# EAGLE design basic (EAGLE 9.6.2)
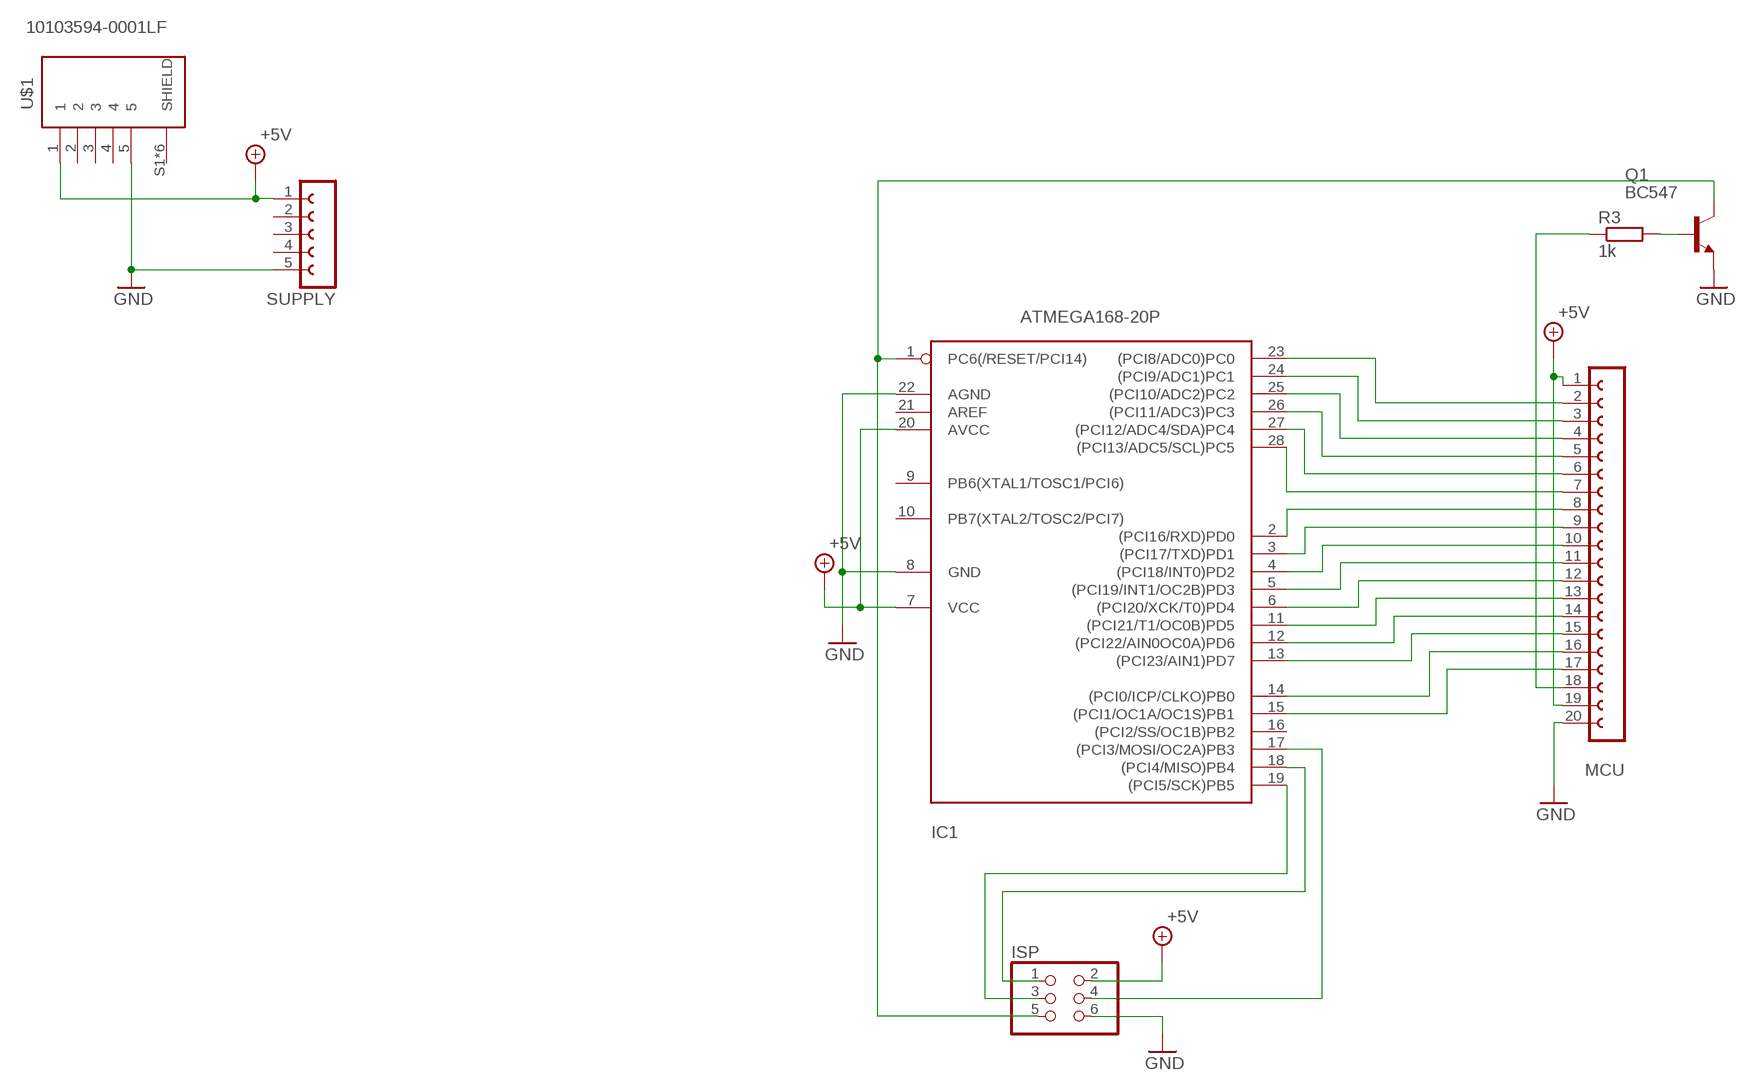
[diagram p0: schematic, sheet 1]

## Parts
IC1  ATMEGA168-20P  [DIL28-3]
ISP  PINHD-2X3  [2X03]
MCU  FE20-1  [FE20]
Q1  BC547  [TO92]
R3  1k  R-EU_0207/10  [0207/10]
SUPPLY  FE05-1  [FE05-1]
U$1  10103594-0001LF  [FCI_10103594-0001LF]

## Nets
+5V: IC1.7(VCC) IC1.20(AVCC) ISP.2 MCU.1 MCU.19 SUPPLY.1 U$1.1
GND: IC1.8(GND) IC1.22(AGND) ISP.6 MCU.20 Q1.1(E) SUPPLY.5 U$1.5
N$1: IC1.17((PCI3/MOSI/OC2A)PB3) ISP.4
N$2: MCU.18 R3.1
N$3: IC1.18((PCI4/MISO)PB4) ISP.1
N$4: IC1.19((PCI5/SCK)PB5) ISP.3
N$5: IC1.23((PCI8/ADC0)PC0) MCU.2
N$6: IC1.24((PCI9/ADC1)PC1) MCU.3
N$7: IC1.25((PCI10/ADC2)PC2) MCU.4
N$8: IC1.26((PCI11/ADC3)PC3) MCU.5
N$9: IC1.27((PCI12/ADC4/SDA)PC4) MCU.6
N$10: IC1.28((PCI13/ADC5/SCL)PC5) MCU.7
N$11: IC1.2((PCI16/RXD)PD0) MCU.8
N$12: IC1.3((PCI17/TXD)PD1) MCU.9
N$13: IC1.4((PCI18/INT0)PD2) MCU.10
N$14: IC1.5((PCI19/INT1/OC2B)PD3) MCU.11
N$15: IC1.6((PCI20/XCK/T0)PD4) MCU.12
N$16: IC1.11((PCI21/T1/OC0B)PD5) MCU.13
N$17: Q1.2(B) R3.2
N$18: IC1.12((PCI22/AIN0OC0A)PD6) MCU.14
N$19: IC1.1(PC6(/RESET/PCI14)) ISP.5 Q1.3(C)
N$20: IC1.13((PCI23/AIN1)PD7) MCU.15
N$21: IC1.14((PCI0/ICP/CLKO)PB0) MCU.16
N$22: IC1.15((PCI1/OC1A/OC1S)PB1) MCU.17
Unconnected: IC1.9(PB6(XTAL1/TOSC1/PCI6)) IC1.10(PB7(XTAL2/TOSC2/PCI7)) IC1.16((PCI2/SS/OC1B)PB2) IC1.21(AREF) SUPPLY.2 SUPPLY.3 SUPPLY.4 U$1.2 U$1.3 U$1.4 U$1.S1(SHIELD) U$1.S2(SHIELD) U$1.S3(SHIELD) U$1.S4(SHIELD) U$1.S5(SHIELD) U$1.S6(SHIELD)

## Library data of the parts
IC1 = adafruit:ATMEGA168*P: MICROCONTROLLER 16 kBytes FLASH 1 kBytes SRAM 512 Bytes EEPROM USART 8-channel 10 bit ADC
ISP = pinhead:PINHD-2X3: PIN HEADER
MCU = con-lsta:FE20-1: FEMALE HEADER; OC_FARNELL: unknown; OC_NEWARK: unknown
Q1 = transistor-npn:BC547*: NPN Transistor
R3 = rcl:R-EU_: RESISTOR, European symbol; SPICEPREFIX: R
SUPPLY = con-lsta:FE05-1: FEMALE HEADER; OC_FARNELL: unknown; OC_NEWARK: unknown
U$1 = 10103594-0001LF:10103594-0001LF: Micro Usb, 2.0 Type b, Receptacle, Smt; ARROW_ELECTRONICS-PURCHASE-URL: https://snapeda.com/shop?store=Arrow+Electronics&id=1078241; DESCRIPTION: USB - micro B USB 2.0 Receptacle Connector 5 Position Surface Mount, Right Angle; Through Hole; DIGI-KEY_PART_NUMBER: 609-4050-1-ND; DIGIKEY-PURCHASE-URL: https://snapeda.com/shop?store=DigiKey&id=1078241; MF: Amphenol ICC; MOUSER-PURCHASE-URL: https://snapeda.com/shop?store=Mouser&id=1078241; MP: 10103594-0001LF; PACKAGE: None

## Board
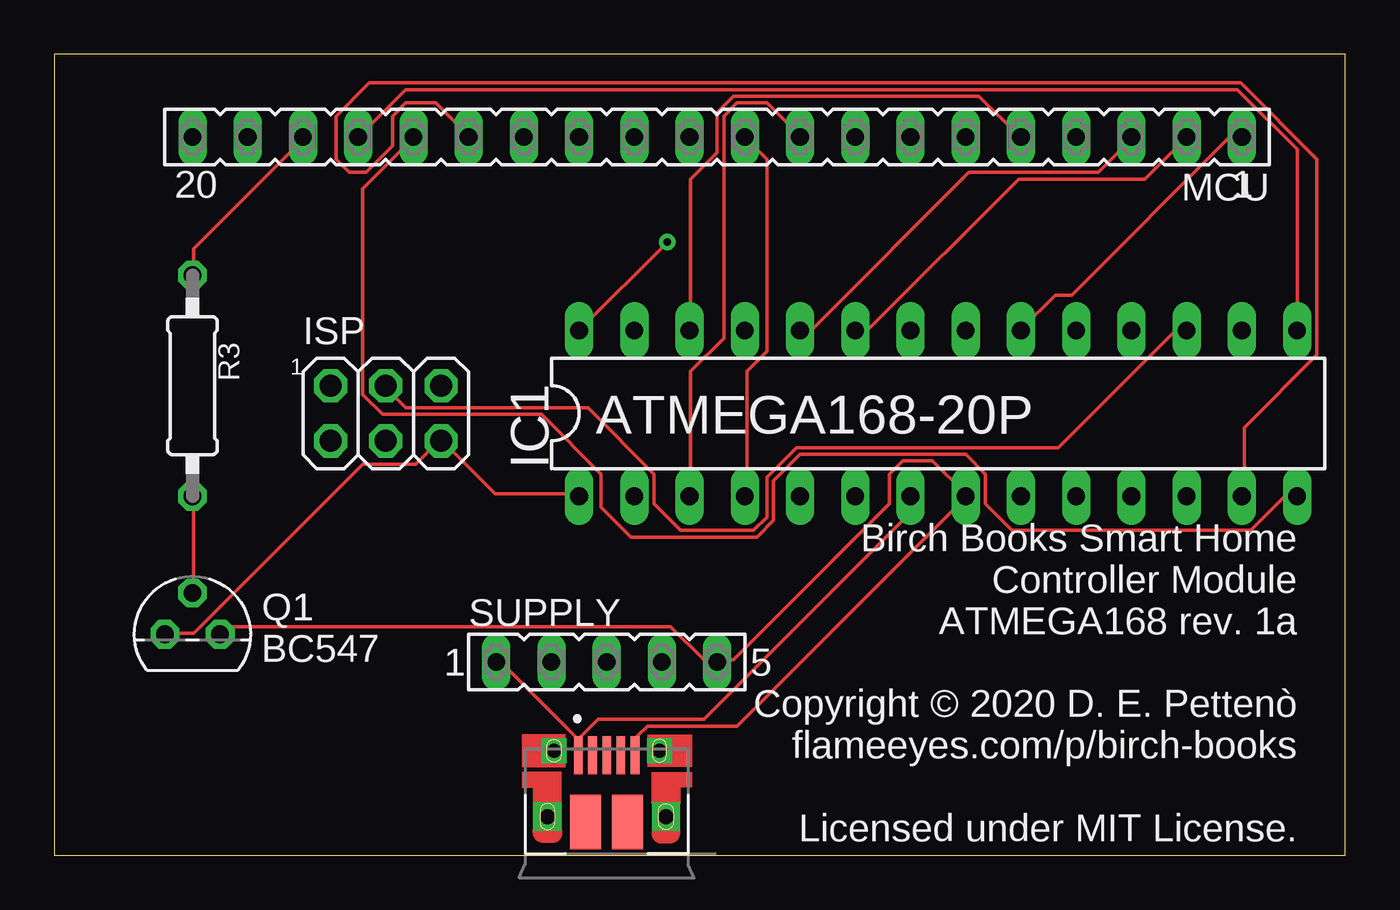
[diagram p1: board, top side]
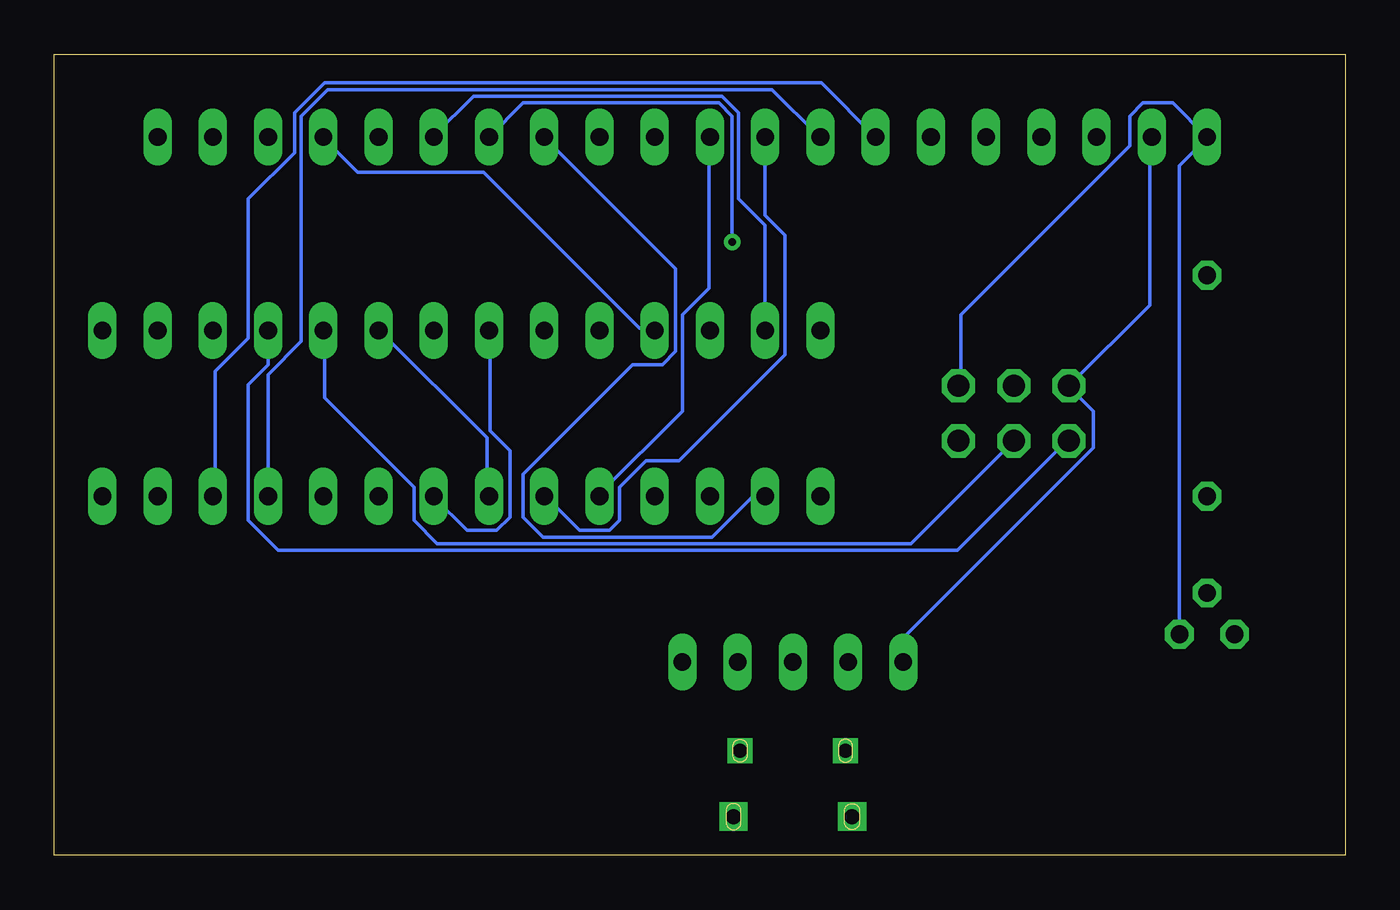
[diagram p2: board, bottom side, seen from below]

Size 59.36 x 36.82 mm. Coordinates in mm from the lower left corner, seen from the top.
Outline: 0,0 59.36,0 59.36,36.82 0,36.82 0,0
Copper layers (1*16): Top 0.035mm / dielectric 1.5mm / Bottom 0.035mm
Design rules "default": minimum track width 6mil, minimum drill 0.35mm, track to track 6mil, track to pad 6mil, pad to pad 6mil, via to via 6mil, smd to smd 6mil, copper to edge 40mil, drill to drill 6mil, minimum pad ring 10mil, minimum via ring 8mil, stop-mask expansion 4mil, vias tented up to drill 0mil, thermal gap 10mil

### Footprints (pad centres in the part's own frame; a part is rotated, then mirrored left to right if it is on the bottom)
DIL28-3 = drill 0.813 long: 1 -16.51,-3.81; 2 -13.97,-3.81; 3 -11.43,-3.81; 4 -8.89,-3.81; 5 -6.35,-3.81; 6 -3.81,-3.81; 7 -1.27,-3.81; 8 1.27,-3.81; 9 3.81,-3.81; 10 6.35,-3.81; 11 8.89,-3.81; 12 11.43,-3.81; 13 13.97,-3.81; 14 16.51,-3.81; 15 16.51,3.81; 16 13.97,3.81; 17 11.43,3.81; 18 8.89,3.81; 19 6.35,3.81; 20 3.81,3.81; 21 1.27,3.81; 22 -1.27,3.81; 23 -3.81,3.81; 24 -6.35,3.81; 25 -8.89,3.81; 26 -11.43,3.81; 27 -13.97,3.81; 28 -16.51,3.81
2X03 = drill 1.016 octagon: 1 -2.54,-1.27; 2 -2.54,1.27; 3 0,-1.27; 4 0,1.27; 5 2.54,-1.27; 6 2.54,1.27
FE20 = drill 0.813 long: 1 -24.13,0; 2 -21.59,0; 3 -19.05,0; 4 -16.51,0; 5 -13.97,0; 6 -11.43,0; 7 -8.89,0; 8 -6.35,0; 9 -3.81,0; 10 -1.27,0; 11 1.27,0; 12 3.81,0; 13 6.35,0; 14 8.89,0; 15 11.43,0; 16 13.97,0; 17 16.51,0; 18 19.05,0; 19 21.59,0; 20 24.13,0
TO92 = drill 0.813 octagon: 1 1.27,0; 2 0,1.905; 3 -1.27,0
0207/10 = drill 0.813 octagon: 1 -5.08,0; 2 5.08,0
FE05-1 = drill 0.813 long: 1 -5.08,0; 2 -2.54,0; 3 0,0; 4 2.54,0; 5 5.08,0
FCI_10103594-0001LF = smd 0.4 x 1.75: 1 -1.3,2.825; 2 -0.65,2.825; 3 0,2.825; 4 0.65,2.825; 5 1.3,2.825 | smd 1.425 x 2.5: S1 -0.963,-0.25; S2 0.963,-0.25 | drill 0.65 pad 1.05 square: S3 -2.425,3.03; S4 2.425,3.03 | drill 0.7 pad 1.3 square: S5 -2.725,0; S6 2.725,0

### Placement (x,y rotation side)
IC1  40.64,20.32 0 top
ISP  15.24,20.32 0 top
MCU  30.48,33.02 180 top
Q1  6.35,10.16 0 top
R3  6.35,21.59 270 top
SUPPLY  25.4,8.89 0 top
U$1  25.4,1.78 0 top

### Tracks (layer width: path | path; a pad name or v marks a point on that pad's centre or on a via)
+5V
  Top 0.152: MCU.1 54.56,32.92 53.95,32.92 46.79,25.76 46.02,25.76 44.5,24.23 IC1.20 | 24.08,5.33 24.08,4.72 U$1.1 24.08,5.33 | 24.08,5.33 20.42,8.99 SUPPLY.1 | 24.08,5.33 24.99,6.25 29.87,6.25 39.32,15.7 39.32,16.46 IC1.7
  Bottom 0.152: IC1.7 39.47,16.61 39.47,19.2 44.35,24.08 IC1.20 | MCU.19 8.99,32.92 8.99,25.3 ISP.2 12.65,21.49 11.58,20.42 11.58,18.75 20.27,10.06 20.27,8.99 SUPPLY.1
GND
  Top 0.152: U$1.5 26.82,4.72 26.82,5.49 27.28,5.94 31.39,5.94 41.91,16.46 IC1.8 41.91,16.61 40.39,18.14 39.01,18.14 38.41,17.53 38.41,16.15 31.24,8.99 30.48,8.99 | 30.48,8.99 29.87,8.99 28.35,10.52 7.92,10.52 7.62,10.21 Q1.1 | 30.48,8.99 SUPPLY.5
  Bottom 0.152: IC1.22 39.32,24.08 39.32,19.51 38.41,18.59 38.41,15.54 39.01,14.94 40.39,14.94 41.91,16.46 IC1.8 | Q1.1 7.62,31.7 6.4,32.92 MCU.20 7.92,34.59 9.3,34.59 9.91,33.98 9.91,32.61 17.68,24.84 17.68,21.64 ISP.6
N$1
  Top 0.152: IC1.17 51.97,24.08 51.51,24.08 46.18,18.75 34.14,18.75 32.77,17.37 32.77,15.54 32.16,14.94 28.8,14.94 27.58,16.15 27.58,17.53 24.54,20.57 16.15,20.57 15.24,21.49 ISP.4
N$2
  Top 0.152: R3.1 6.4,26.67 6.4,27.89 11.43,32.92 MCU.18
N$3
  Bottom 0.152: IC1.18 49.53,22.55 50.44,21.64 50.44,15.39 49.07,14.02 17.83,14.02 12.8,19.05 ISP.1
N$4
  Bottom 0.152: ISP.3 19.96,14.33 41.76,14.33 42.82,15.39 42.82,16.92 46.94,21.03 46.94,24.08 IC1.19
N$5
  Top 0.152: MCU.2 50.14,31.09 44.35,31.09 37.49,24.23 36.88,24.23 IC1.23
N$6
  Top 0.152: IC1.24 34.29,24.23 34.9,24.23 42.06,31.39 48.01,31.39 49.53,32.92 MCU.3
N$7
  Bottom 0.152: IC1.25 31.85,24.23 32.46,24.23 39.62,31.39 45.41,31.39 46.94,32.92 MCU.4
N$8
  Top 0.152: IC1.26 29.26,24.23 29.26,31.09 30.48,32.31 30.48,34.14 31.24,34.9 42.52,34.9 44.35,33.07 MCU.5
N$9
  Bottom 0.152: IC1.27 26.67,28.96 27.89,30.18 27.89,34.14 28.65,34.9 40.08,34.9 41.91,33.07 MCU.6
N$10  (via drill 0.35)
  Top 0.152: v28.19,28.19 IC1.28
  Bottom 0.152: v28.19,28.19 28.19,33.98 28.8,34.59 37.8,34.59 MCU.7
N$11
  Bottom 0.152: MCU.8 30.79,26.98 30.79,23.16 31.39,22.55 32.77,22.55 37.8,17.53 37.8,15.54 36.88,14.63 29.11,14.63 27.28,16.46 26.67,16.46 IC1.2
N$12
  Top 0.152: IC1.3 29.26,16.61 29.26,22.25 30.79,23.77 30.79,33.98 31.39,34.59 32.77,34.59 34.29,33.07 MCU.9
N$13
  Top 0.152: MCU.10 32.77,32 32.77,23.16 31.85,22.25 31.85,16.61 IC1.4
N$14
  Bottom 0.152: MCU.11 29.26,32.92 29.26,26.06 30.48,24.84 30.48,20.42 34.29,16.61 IC1.5
N$15
  Bottom 0.152: MCU.12 26.67,29.41 25.76,28.5 25.76,23.01 30.63,18.14 32.16,18.14 33.38,16.92 33.38,15.39 33.83,14.94 35.2,14.94 36.73,16.46 IC1.6
N$16
  Bottom 0.152: IC1.11 49.53,22.1 48.01,23.62 48.01,33.98 46.79,35.2 26.36,35.2 24.23,33.07 MCU.13
N$17
  Top 0.152: Q1.2 6.4,12.19 6.4,16.46 R3.2
N$18
  Bottom 0.152: MCU.14 24.08,35.51 46.94,35.51 48.31,34.14 48.31,32.31 50.44,30.18 50.44,23.77 51.97,22.25 51.97,16.61 IC1.12
N$19
  Top 0.152: Q1.3 5.18,10.21 6.4,10.21 14.17,17.98 16.61,17.98 17.68,19.05 ISP.5 17.83,19.05 20.27,16.61 24.08,16.61 IC1.1
N$20
  Top 0.152: IC1.13 54.71,16.61 54.71,19.66 58.06,23.01 58.06,32 54.56,35.51 14.48,35.51 12.95,33.98 12.95,32 13.56,31.39 14.33,31.39 15.54,32.61 15.54,33.98 16.15,34.59 17.53,34.59 19.05,33.07 MCU.15
N$21
  Top 0.152: IC1.14 57.15,16.46 56.54,16.46 55.02,14.94 44.04,14.94 42.82,16.15 42.82,17.53 41.91,18.44 34.29,18.44 33.07,17.22 33.07,15.39 32.31,14.63 26.52,14.63 25.15,16 25.15,17.53 22.4,20.27 15.09,20.27 14.17,21.18 14.17,30.63 16.46,32.92 MCU.16
N$22
  Top 0.152: IC1.15 57.15,32.46 54.41,35.2 16.15,35.2 MCU.17

### Text on the board
tPlace: 1 | Birch Books Smart Home / Controller Module / ATMEGA168 rev. 1a / / Copyright © 2020 D. E. Pettenò / flameeyes.com/p/birch-books / / Licensed under MIT License.